# Altium schematic sheet TempSensor.SchDoc
size A4; SheetNumber: 3; SheetTotal: 10
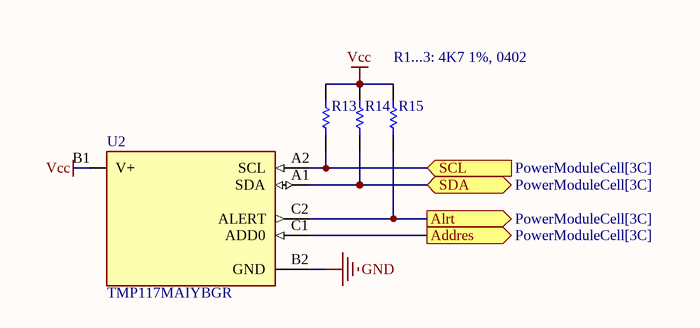
[diagram p0: TempSensor.SchDoc]

## Parts
R13  4K7 1%, 0402  [RESC1005X40X25LL05T05]  (value not drawn)
R14  4K7 1%, 0402  [RESC1005X40X25LL05T05]  (value not drawn)
R15  4K7 1%, 0402  [RESC1005X40X25LL05T05]  (value not drawn)
U2  TMP117MAIYBGR  [FP-YBG0006-MFG]

## Ports
Addres (out, see PowerModuleCell[3C]), Alrt (out, see PowerModuleCell[3C]), SCL (in, see PowerModuleCell[3C]), SDA (bidir, see PowerModuleCell[3C])

## Nets
GND: U2.B2(GND)
Vcc: R13.2 R14.2 R15.2 U2.B1(V+)
Addres: U2.C1(ADD0) ; port Addres
Alrt: R15.1 U2.C2(ALERT) ; port Alrt
SCL: R13.1 U2.A2(SCL) ; port SCL
SDA: R14.1 U2.A1(SDA) ; port SDA

## Notes on the sheet
- R1...3: 4K7 1%, 0402

## Library data of the parts
R13-R15 = CMP-2002-01154-4: Chip Resistor, 4.7 KOhm, +/- 1%, 0.1 W, -55 to 155 degC, 0402 (1005 Metric), RoHS, Tape and Reel; PartNumber: ERJ-2RKF4701X; Voltage Rating: 50 V; Case\/Package: 0402; Power Rating: 100 mW; Height: 0.35 mm; Mounting Technology: Surface Mount; REACH SVHC: Yes; Resistance: 4.7 KOhm; Max Operating Temperature: 155 degC; ComponentLink1Description: Manufacturer URL; ComponentLink2Description: Datasheet; Pins: 2; PackageReference: 0402; Tolerance: 1%; Case Code (Imperial): 0402; Length: 1 mm; PackageDescription: 2-Pin Surface Mount Device, Body 1 x 0.5 mm; RoHSCompliant: true; Package Quantity: 1; Radiation Hardening: No; DatasheetVersion: 04/2015; Width: 0.5 mm; Case Code (Metric): 1005; Mount: Surface Mount; ComponentLink1URL: http://www.panasonic.com/; Min Operating Temperature: -55 degC; Packaging: Cut Tape; ComponentLink2URL: http://industrial.panasonic.com/cdbs/www-data/pdf/RDA0000/AOA0000C86.pdf
U2 = CMP-04948-000037-1: TEMP SENSOR